# EAGLE design CustomHardwareSchematic (EAGLE 8.3.2)
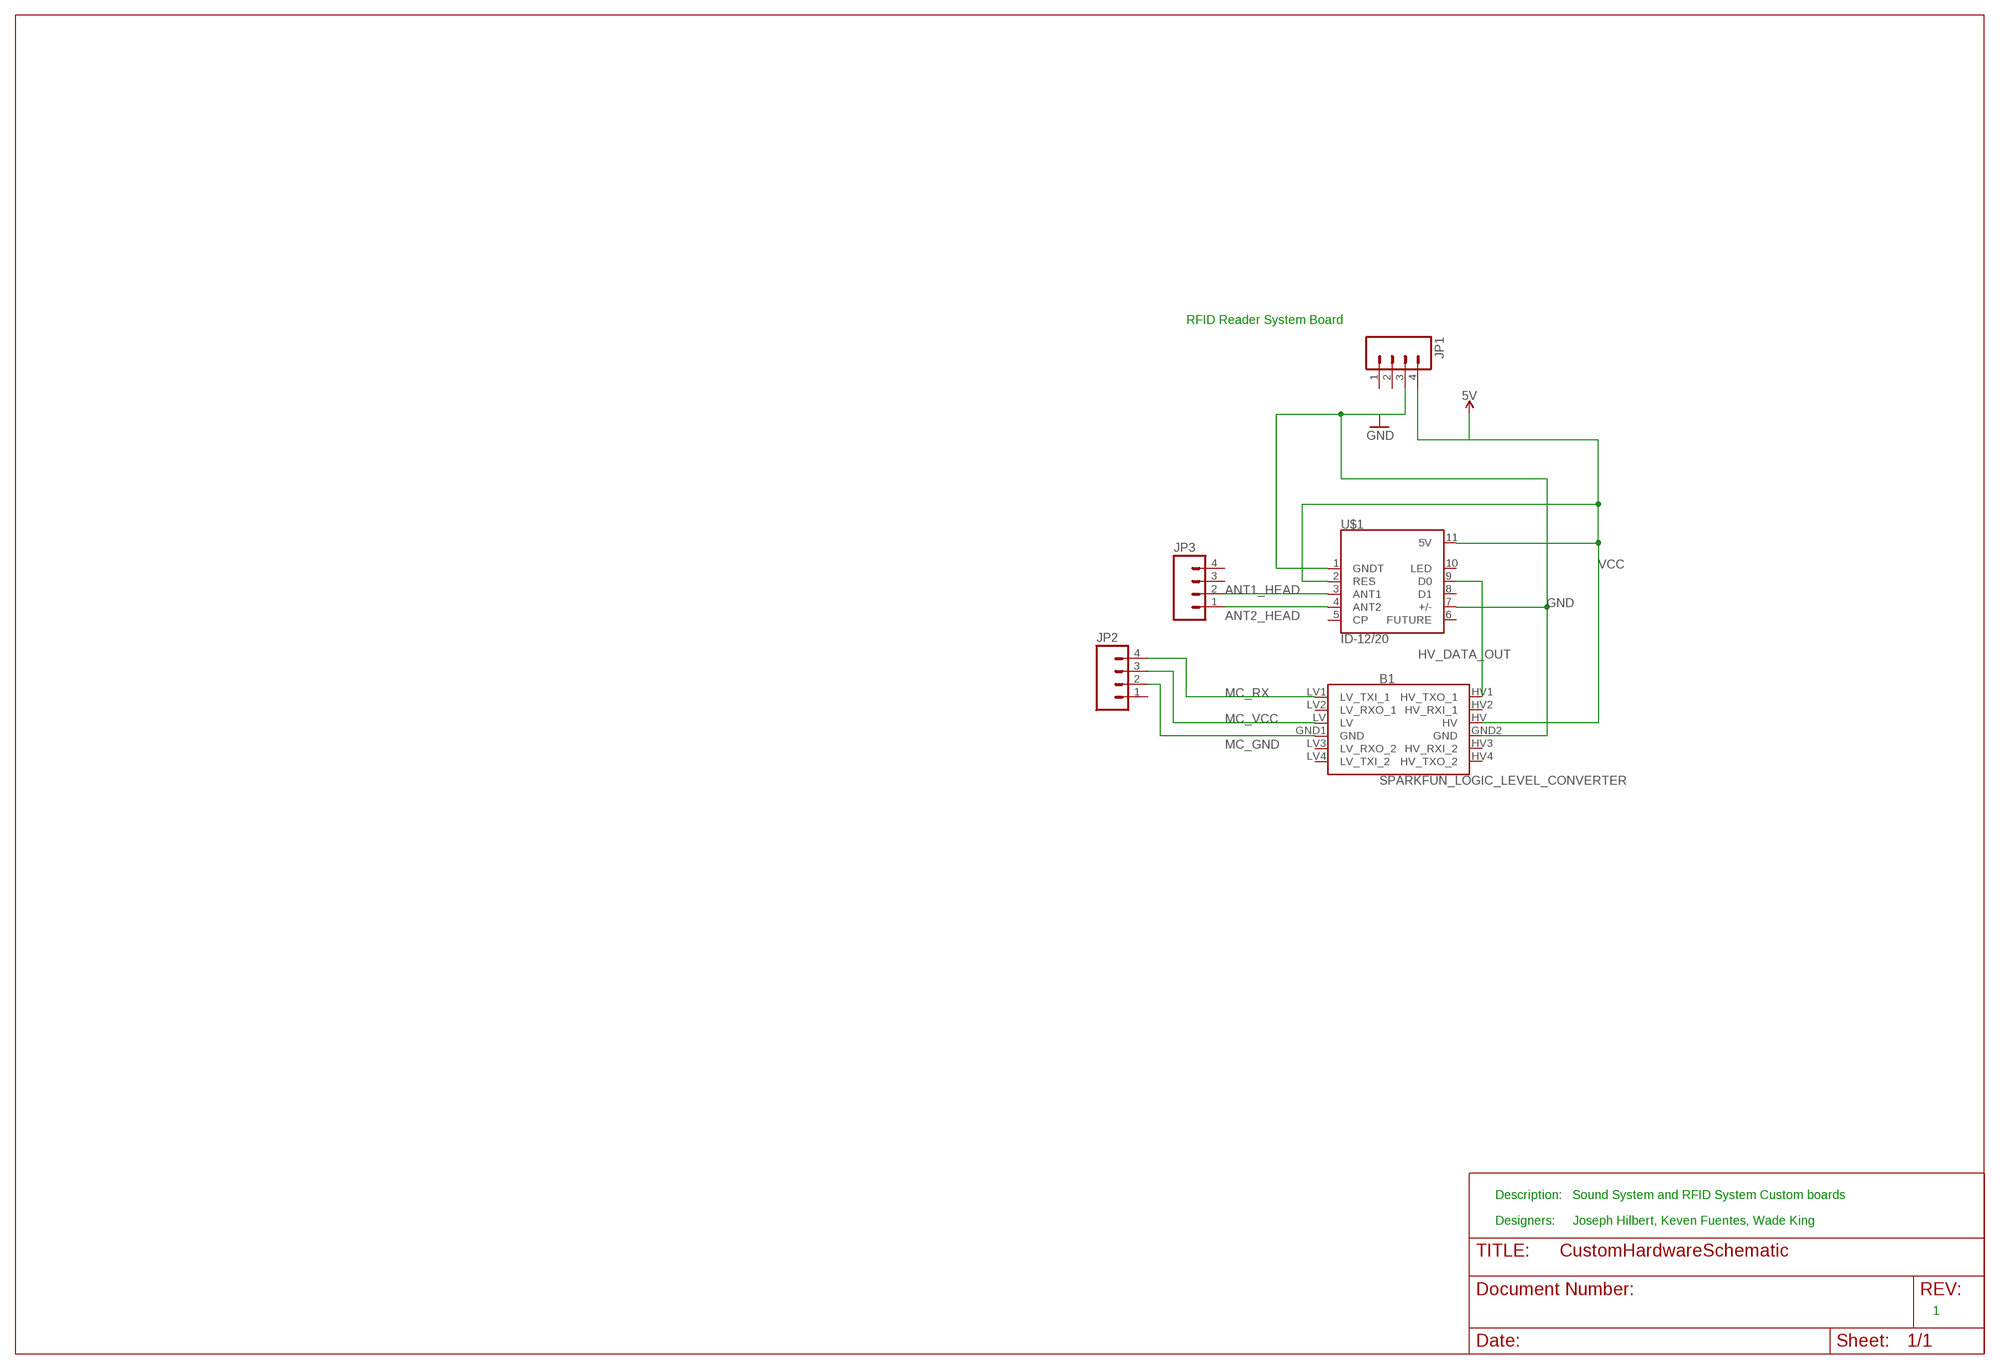
[diagram p0: schematic, sheet 1]

## Parts
B1  SPARKFUN_LOGIC_LEVEL_CONVERTER  [SPARKFUN_LOGIC_LEVEL_CONVERTER]
JP1  M04LOCK  [1X04_LOCK]
JP2  M04LOCK  [1X04_LOCK]
JP3  M04LOCK  [1X04_LOCK]
U$1  ID-12/20  [ID-12]

## Nets
ANT1_HEAD: JP3.2 U$1.3(ANT1)
ANT2_HEAD: JP3.1 U$1.4(ANT2)
GND: B1.GND2(GND) JP1.3 U$1.1(GNDT) U$1.7(+/-)
HV_DATA_OUT: B1.HV1(HV_TXO_1) U$1.9(D0)
MC_GND: B1.GND1(GND) JP2.2
MC_RX: B1.LV1(LV_TXI_1) JP2.4
MC_VCC: B1.LV JP2.3
VCC: B1.HV JP1.4 U$1.2(RES) U$1.11(5V) ; supply symbol labelled 5V
Unconnected: B1.HV2(HV_RXI_1) B1.HV3(HV_RXI_2) B1.HV4(HV_TXO_2) B1.LV2(LV_RXO_1) B1.LV3(LV_RXO_2) B1.LV4(LV_TXI_2) JP1.1 JP1.2 JP2.1 JP3.3 JP3.4 U$1.5(CP) U$1.6(FUTURE) U$1.8(D1) U$1.10(LED)

## Notes on the sheet
- RFID Reader System Board
- Description: | Sound System and RFID System Custom boards
- Designers: | Joseph Hilbert, Keven Fuentes, Wade King
- 1

## Library data of the parts
B1 = SparkFun-Boards:SPARKFUN_LOGIC_LEVEL_CONVERTER: SparkFun Logic Level Converter -Bi-Directional This is the mechnical outline for the 3.3V - 5V bi directional logic level converter. *Note, the "LOCK" Package has the header pins staggered by an offset of 5 mils (off center line), so that when you slide a row of standard 0.1" headers into the PTH pads, it will hold position vertically. See the follwing turorial for more information on this type of special footprints: Sneaky Footprints <https://www.sparkfun.com/tutorials/114> SparkFun Products: SparkFun Logic Level Converter - Bi-Directional <https://www.sparkfun.com/products/12009>
JP1-JP3 = Moo1.2:M04: Header 4 Standard 4-pin 0.1" header. Use with straight break away headers (SKU : PRT-00116), right angle break away headers (PRT-00553), swiss pins (PRT-00743), machine pins (PRT-00117), and female headers (PRT-00115). Molex polarized connector foot print use with SKU : PRT-08231 with associated crimp pins and housings. 1MM SMD Version SKU: PRT-10208
U$1 = SparkFun-RF:ID-12/20: ID Innovations 125kHz RFID Reader (ID2, ID3, ID12, and ID20) The IDS, ID3, ID12, and ID20 are very simple to use RFID reader modules. Power the module, hold up a 125kHz card, and get a serial string output containing the unique ID of the card. SparkFun Products RFID Reader ID-3LA (125 kHz) <https://www.sparkfun.com/products/11862> (SEN-11862) RFID Reader ID-12LA (125 kHz) <https://www.sparkfun.com/products/11827> (SEN-11827) RFID Reader ID-20LA (125 kHz) <https://www.sparkfun.com/products/11828> (SEN-11828) SparkFun RFID USB Reader <https://www.sparkfun.com/products/9963> (SEN-9963); PROD_ID: CONN-08875

## Board
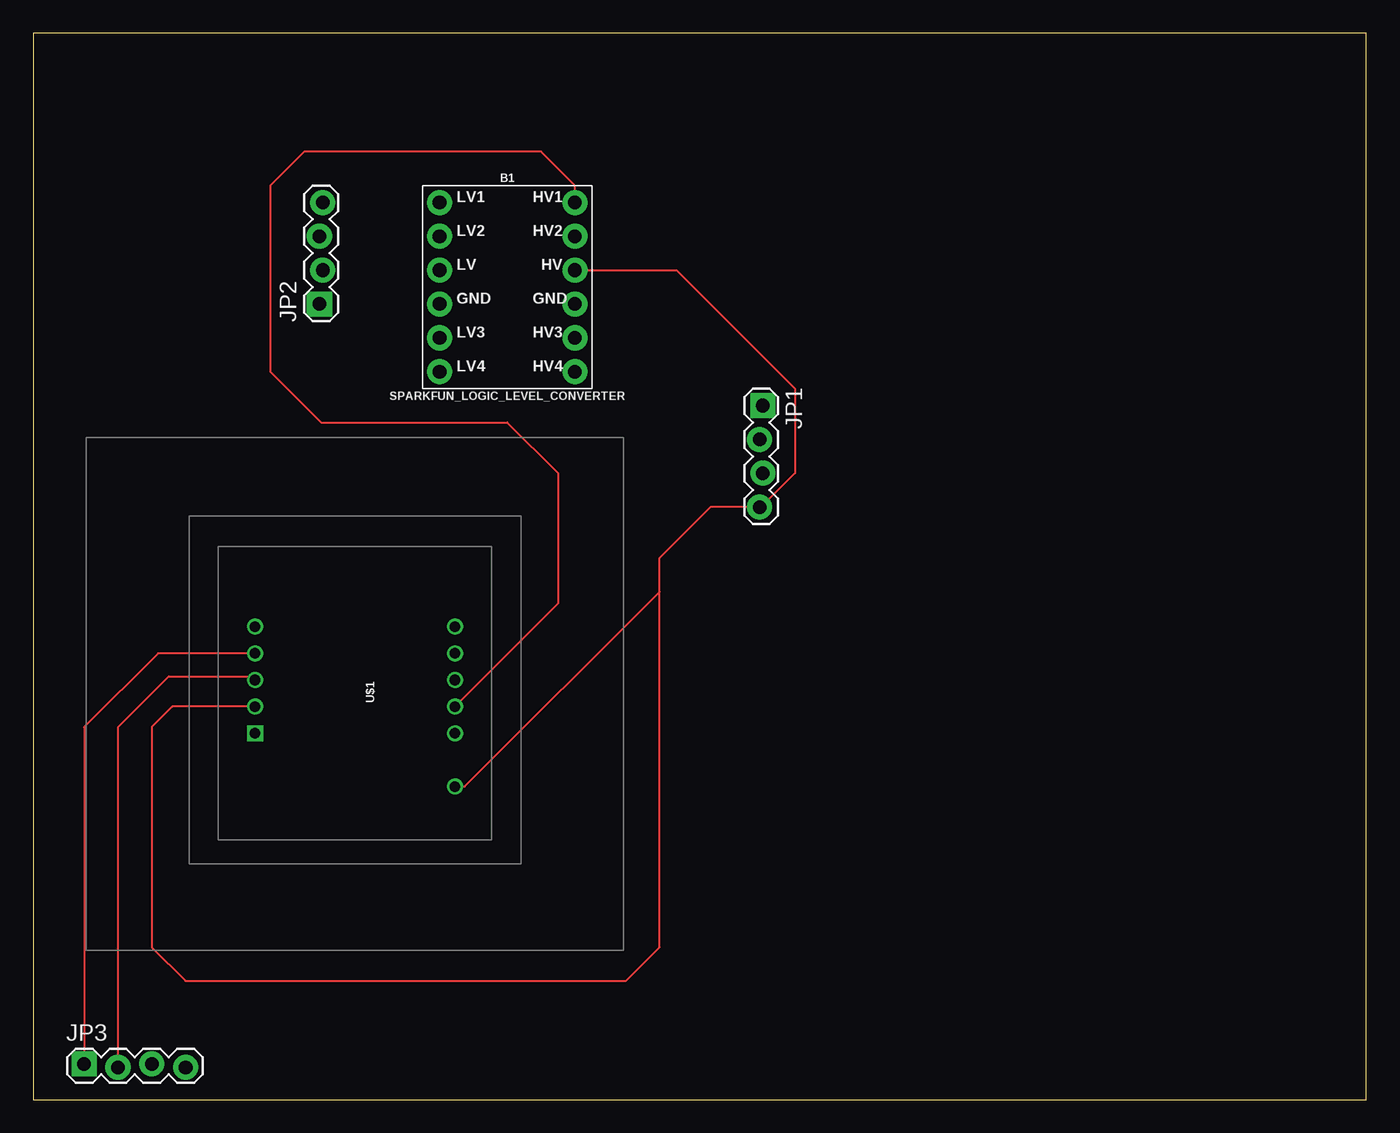
[diagram p1: board, top side]
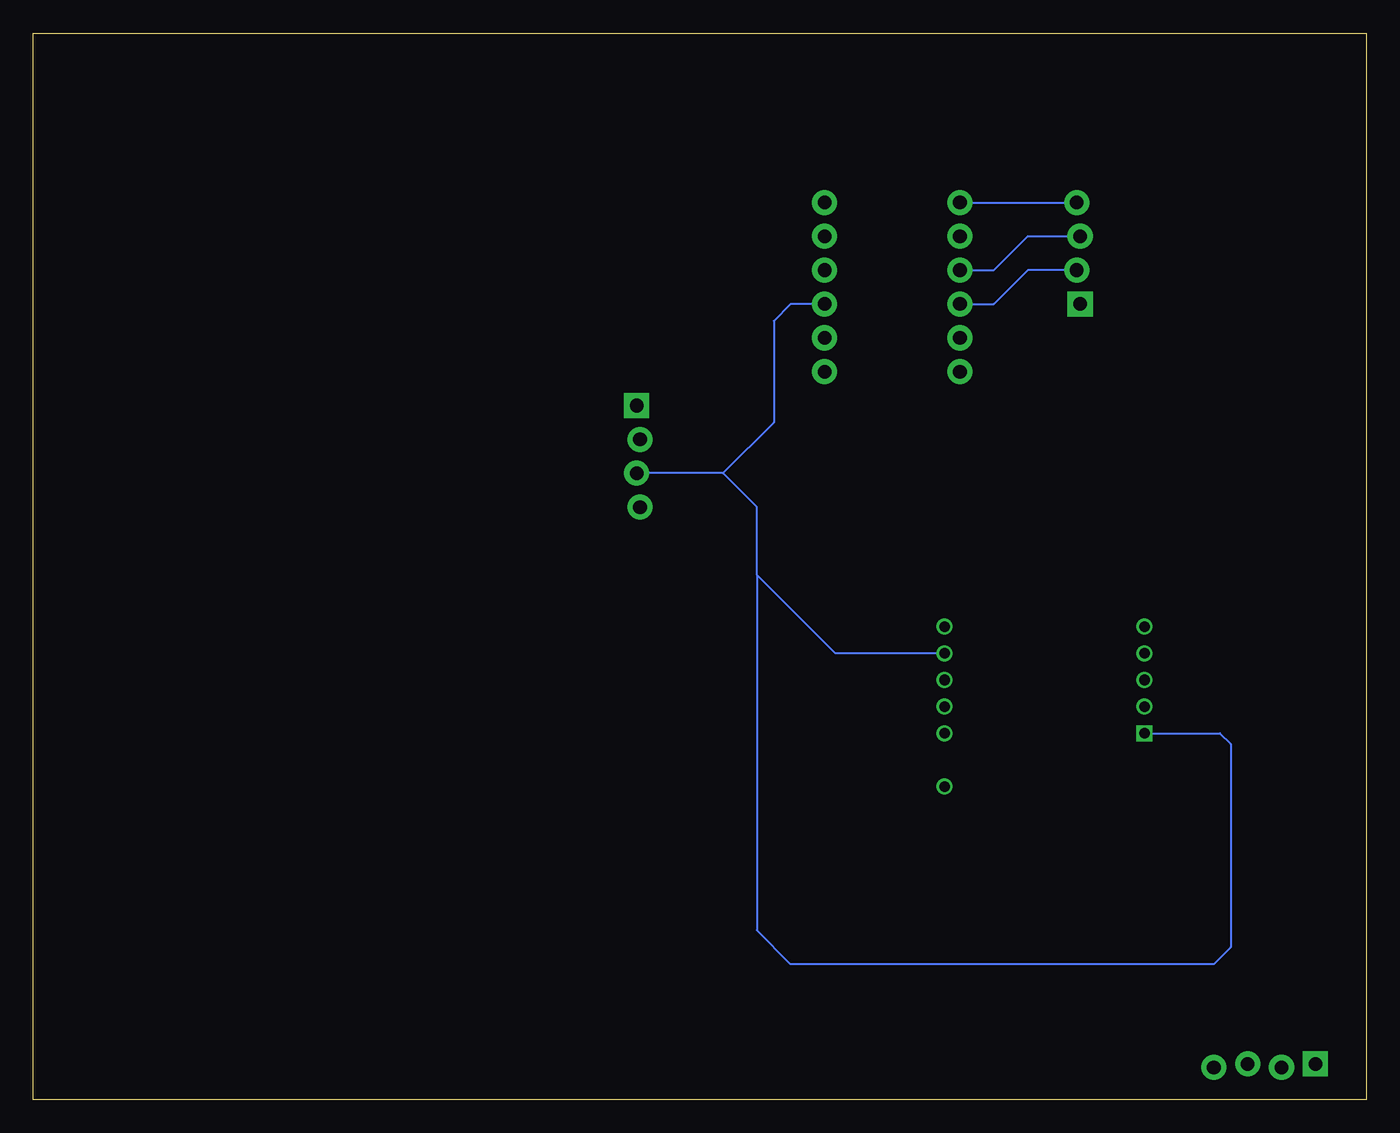
[diagram p2: board, bottom side, seen from below]

Size 100 x 80 mm. Coordinates in mm from the lower left corner, seen from the top.
Outline: 0,0 100,0 100,80 0,80 0,0
Copper layers (1*16): Top 0.0356mm / dielectric 1.5011mm / Bottom 0.0356mm
Design rules "oshpark-2layer": minimum track width 6mil, minimum drill 13mil, track to track 6mil, track to pad 6mil, pad to pad 6mil, via to via 6mil, smd to smd 6mil, copper to edge 15mil, drill to drill 6mil, minimum pad ring 7mil, minimum via ring 7mil, stop-mask expansion 2.5mil, vias tented up to drill 0mil, thermal gap 10mil

### Footprints (pad centres in the part's own frame; a part is rotated, then mirrored left to right if it is on the bottom)
SPARKFUN_LOGIC_LEVEL_CONVERTER = drill 1.016 pad 1.88: GND1 -5.08,-1.27; GND2 5.08,-1.27; HV 5.08,1.27; HV1 5.08,6.35; HV2 5.08,3.81; HV3 5.08,-3.81; HV4 5.08,-6.35; LV -5.08,1.27; LV1 -5.08,6.35; LV2 -5.08,3.81; LV3 -5.08,-3.81; LV4 -5.08,-6.35
1X04_LOCK = drill 1.016 pad 1.88 square: 1 0,0.127 | drill 1.016 pad 1.88: 2 2.54,-0.127; 3 5.08,0.127; 4 7.62,-0.127
ID-12 = drill 0.8 square: 1 3,-7.5 | drill 0.8: 2 1,-7.5; 3 -1,-7.5; 4 -3,-7.5; 5 -5,-7.5; 6 -5,7.5; 7 -3,7.5; 8 -1,7.5; 9 1,7.5; 10 3,7.5; 11 7,7.5

### Placement (x,y rotation side)
B1  35.56,60.96 0 top
JP1  54.61,52.07 270 top
JP2  21.59,59.69 90 top
JP3  3.81,2.54 0 top
U$1  24.13,30.48 270 top

### Tracks (layer width: path | path; a pad name or v marks a point on that pad's centre or on a via)
ANT1_HEAD
  Top 0.152: JP3.2 6.35,27.94 10.16,31.75 16.36,31.75 U$1.3
ANT2_HEAD
  Top 0.152: U$1.4 9.35,33.48 3.81,27.94 JP3.1
GND
  Bottom 0.152: U$1.1 10.97,27.48 10.16,26.67 10.16,11.43 11.43,10.16 43.18,10.16 45.72,12.7 45.72,39.37 | 45.72,39.37 45.72,44.45 48.26,46.99 | 48.26,46.99 JP1.3 | B1.GND2 43.18,59.69 44.45,58.42 44.45,50.8 48.26,46.99 | U$1.7 39.83,33.48 45.72,39.37
HV_DATA_OUT
  Top 0.152: B1.HV1 40.64,68.58 38.1,71.12 20.32,71.12 17.78,68.58 17.78,54.61 21.59,50.8 35.56,50.8 39.37,46.99 39.37,37.22 U$1.9
MC_GND
  Bottom 0.152: B1.GND1 27.94,59.69 25.4,62.23 21.59,62.23 JP2.2
MC_RX
  Bottom 0.152: B1.LV1 JP2.4
MC_VCC
  Bottom 0.152: B1.LV 27.94,62.23 25.4,64.77 JP2.3
VCC
  Top 0.152: U$1.2 10.43,29.48 8.89,27.94 8.89,11.43 11.43,8.89 44.45,8.89 46.99,11.43 46.99,38.1 | U$1.11 32.37,23.48 46.99,38.1 | 46.99,38.1 46.99,40.64 50.8,44.45 54.61,44.45 | B1.HV 48.26,62.23 57.15,53.34 57.15,46.99 54.61,44.45 | JP1.4 54.61,44.45